# EAGLE schematic Treiber für Stepper-Motoren v14 (EAGLE 9.7.0)
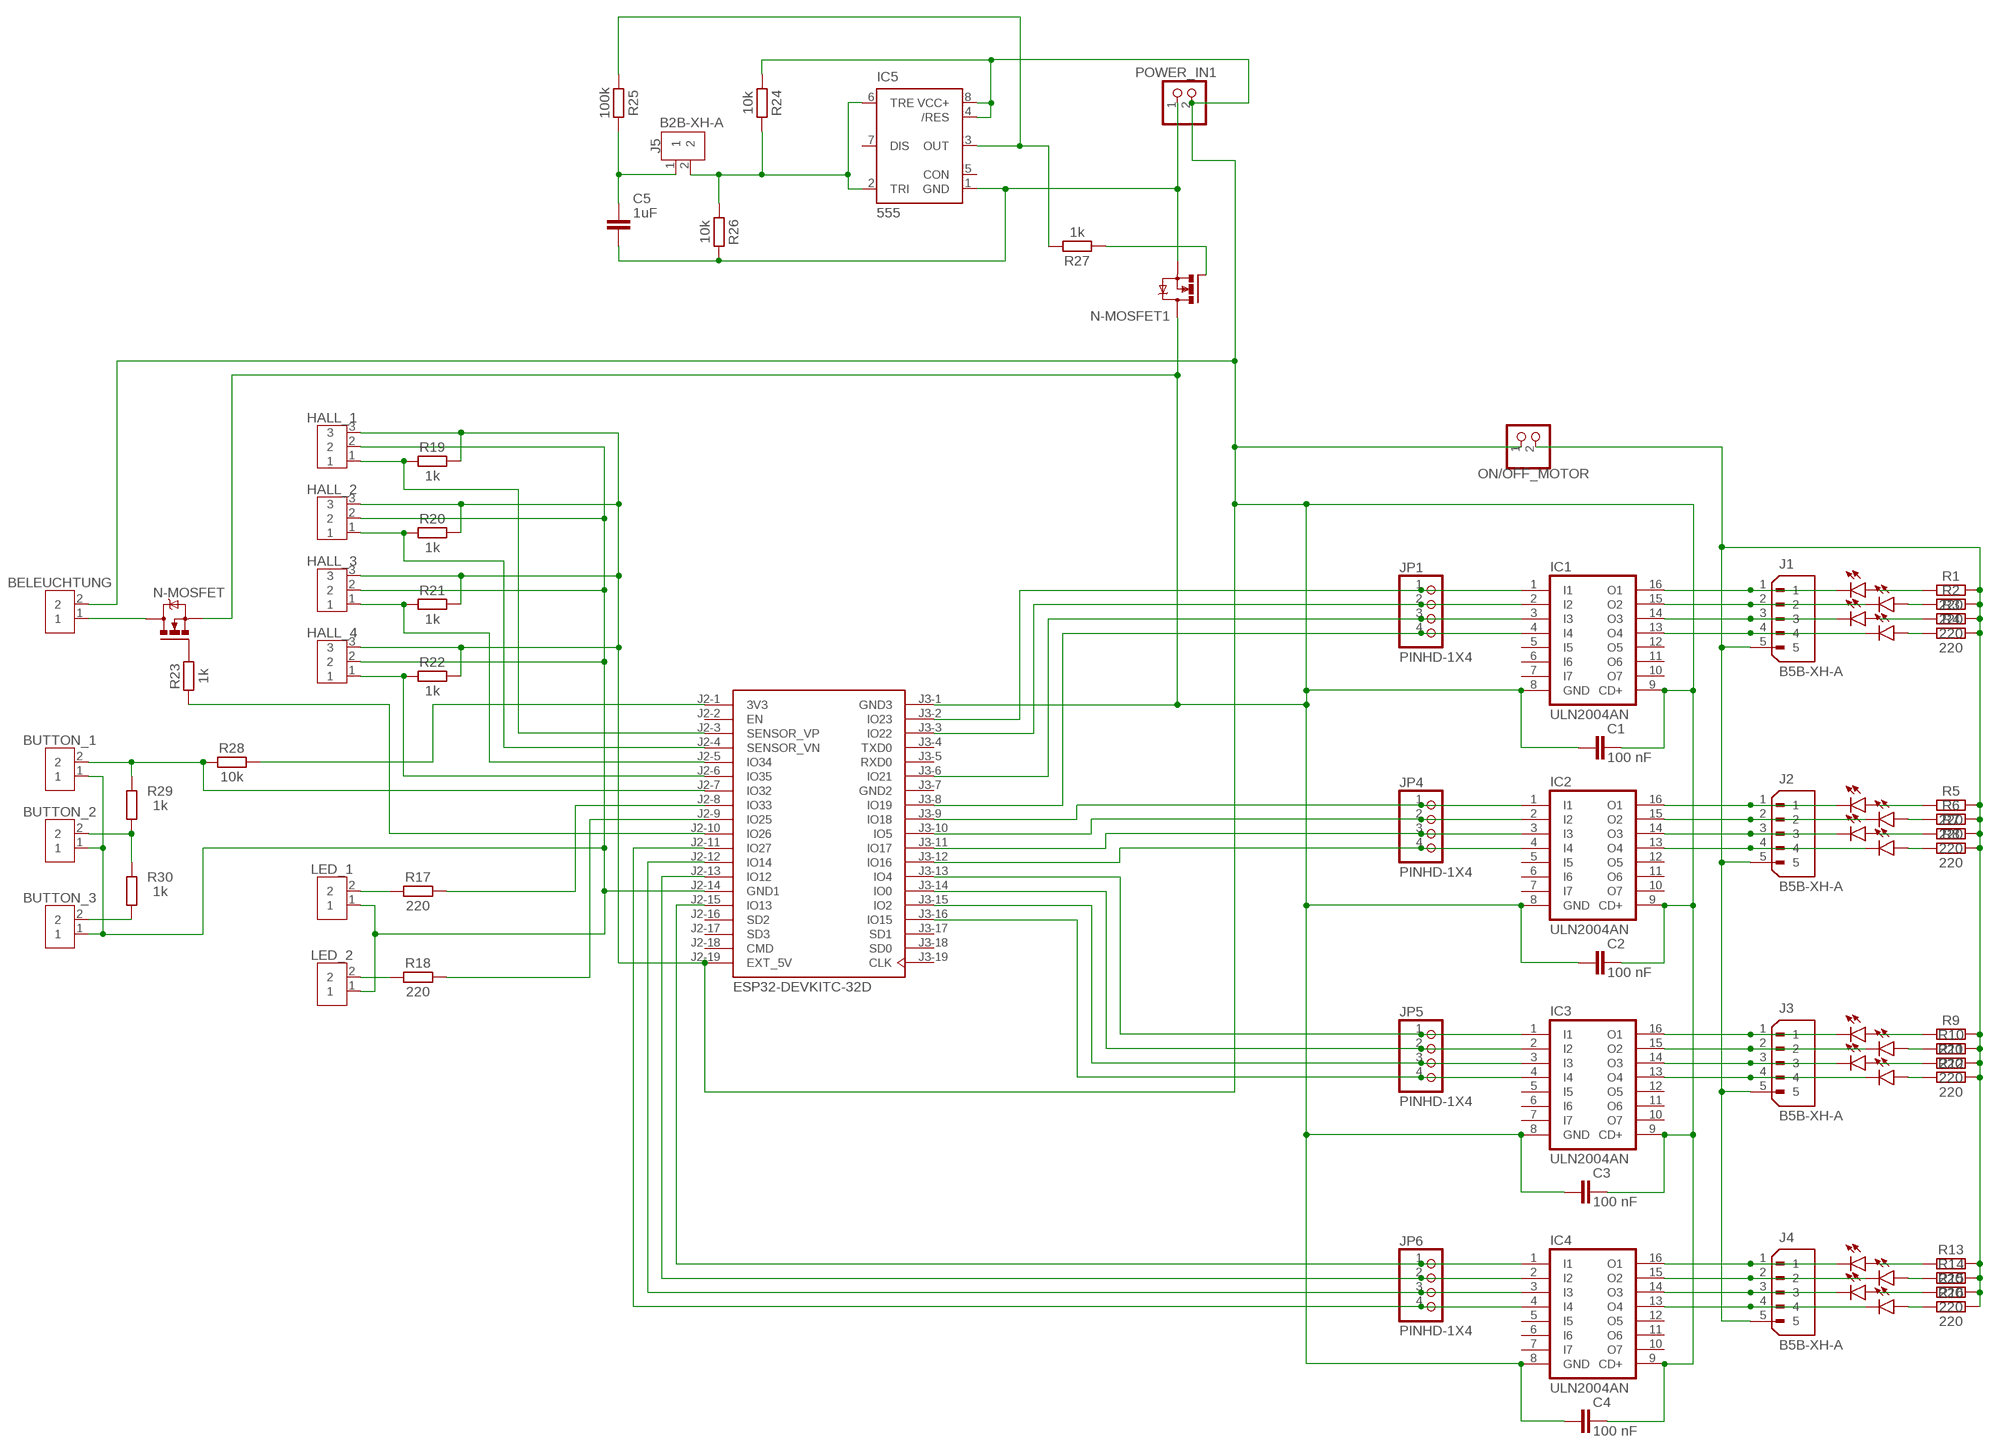
[diagram p0: schematic, sheet 1]

## Parts
BELEUCHTUNG  B2B-XH-A  [B2B-XH-A]
BUTTON_1  B2B-XH-A  [B2B-XH-A]
BUTTON_2  B2B-XH-A  [B2B-XH-A]
BUTTON_3  B2B-XH-A  [B2B-XH-A]
C1  100 nF  C_CHIP-0402(1005-METRIC)  [CAPC1005X60]
C2  100 nF  C_CHIP-0402(1005-METRIC)  [CAPC1005X60]
C3  100 nF  C_CHIP-0402(1005-METRIC)  [CAPC1005X60]
C4  100 nF  C_CHIP-0402(1005-METRIC)  [CAPC1005X60]
C5  1uF  C_CHIP-0603(1608-METRIC)  [CAPC1608X85]
D1  LED_RED  CHIP-FLAT-R_0402  [LEDC1005X25N_FLAT-R]
D2  LED_RED  CHIP-FLAT-R_0402  [LEDC1005X25N_FLAT-R]
D3  LED_RED  CHIP-FLAT-R_0402  [LEDC1005X25N_FLAT-R]
D4  LED_RED  CHIP-FLAT-R_0402  [LEDC1005X25N_FLAT-R]
D5  LED_RED  CHIP-FLAT-R_0402  [LEDC1005X25N_FLAT-R]
D6  LED_RED  CHIP-FLAT-R_0402  [LEDC1005X25N_FLAT-R]
D7  LED_RED  CHIP-FLAT-R_0402  [LEDC1005X25N_FLAT-R]
D8  LED_RED  CHIP-FLAT-R_0402  [LEDC1005X25N_FLAT-R]
D9  LED_RED  CHIP-FLAT-R_0402  [LEDC1005X25N_FLAT-R]
D10  LED_RED  CHIP-FLAT-R_0402  [LEDC1005X25N_FLAT-R]
D11  LED_RED  CHIP-FLAT-R_0402  [LEDC1005X25N_FLAT-R]
D12  LED_RED  CHIP-FLAT-R_0402  [LEDC1005X25N_FLAT-R]
D13  LED_RED  CHIP-FLAT-R_0402  [LEDC1005X25N_FLAT-R]
D14  LED_RED  CHIP-FLAT-R_0402  [LEDC1005X25N_FLAT-R]
D15  LED_RED  CHIP-FLAT-R_0402  [LEDC1005X25N_FLAT-R]
D16  LED_RED  CHIP-FLAT-R_0402  [LEDC1005X25N_FLAT-R]
HALL_1  B3B-XH-A  [B3B-XH-A]
HALL_2  B3B-XH-A  [B3B-XH-A]
HALL_3  B3B-XH-A  [B3B-XH-A]
HALL_4  B3B-XH-A  [B3B-XH-A]
IC1  ULN2004AN  [DIL16]
IC2  ULN2004AN  [DIL16]
IC3  ULN2004AN  [DIL16]
IC4  ULN2004AN  [DIL16]
IC5  555  555D  [SO08]
J1  B5B-XH-A  [JST_B5B-XH-A]
J2  B5B-XH-A  [JST_B5B-XH-A]
J3  B5B-XH-A  [JST_B5B-XH-A]
J4  B5B-XH-A  [JST_B5B-XH-A]
J5  B2B-XH-A  [B2B-XH-A]
JP1  PINHD-1X4  [1X04]
JP4  PINHD-1X4  [1X04]
JP5  PINHD-1X4  [1X04]
JP6  PINHD-1X4  [1X04]
LED_1  B2B-XH-A  [B2B-XH-A]
LED_2  B2B-XH-A  [B2B-XH-A]
N-MOSFET  NMOSFET  NMOSFET_TO220  [TO220BV]
N-MOSFET1  NMOSFET  NMOSFET_TO220  [TO220BV]
ON/OFF_MOTOR  PINHD-1X2  [1X02]
POWER_IN1  PINHD-1X2  [1X02]
R1  220  R_CHIP-0402(1005-METRIC)  [RESC1005X40]
R2  220  R_CHIP-0402(1005-METRIC)  [RESC1005X40]
R3  220  R_CHIP-0402(1005-METRIC)  [RESC1005X40]
R4  220  R_CHIP-0402(1005-METRIC)  [RESC1005X40]
R5  220  R_CHIP-0402(1005-METRIC)  [RESC1005X40]
R6  220  R_CHIP-0402(1005-METRIC)  [RESC1005X40]
R7  220  R_CHIP-0402(1005-METRIC)  [RESC1005X40]
R8  220  R_CHIP-0402(1005-METRIC)  [RESC1005X40]
R9  220  R_CHIP-0402(1005-METRIC)  [RESC1005X40]
R10  220  R_CHIP-0402(1005-METRIC)  [RESC1005X40]
R11  220  R_CHIP-0402(1005-METRIC)  [RESC1005X40]
R12  220  R_CHIP-0402(1005-METRIC)  [RESC1005X40]
R13  220  R_CHIP-0402(1005-METRIC)  [RESC1005X40]
R14  220  R_CHIP-0402(1005-METRIC)  [RESC1005X40]
R15  220  R_CHIP-0402(1005-METRIC)  [RESC1005X40]
R16  220  R_CHIP-0402(1005-METRIC)  [RESC1005X40]
R17  220  R_CHIP-0402(1005-METRIC)  [RESC1005X40]
R18  220  R_CHIP-0402(1005-METRIC)  [RESC1005X40]
R19  1k  R_CHIP-0402(1005-METRIC)  [RESC1005X40]
R20  1k  R_CHIP-0402(1005-METRIC)  [RESC1005X40]
R21  1k  R_CHIP-0402(1005-METRIC)  [RESC1005X40]
R22  1k  R_CHIP-0402(1005-METRIC)  [RESC1005X40]
R23  1k  R_CHIP-0402(1005-METRIC)  [RESC1005X40]
R24  10k  R_CHIP-0603(1608-METRIC)  [RESC1608X60]
R25  100k  R_CHIP-0603(1608-METRIC)  [RESC1608X60]
R26  10k  R_CHIP-0603(1608-METRIC)  [RESC1608X60]
R27  1k  R_CHIP-0402(1005-METRIC)  [RESC1005X40]
R28  10k  R_CHIP-0603(1608-METRIC)  [RESC1608X60]
R29  1k  R_CHIP-0603(1608-METRIC)  [RESC1608X60]
R30  1k  R_CHIP-0603(1608-METRIC)  [RESC1608X60]
U1  ESP32-DEVKITC-32D  [MODULE_ESP32-DEVKITC-32D]

## Nets
N$1: IC1.1(I1) JP1.1 U1.J3-2(IO23)
N$2: IC1.2(I2) JP1.2 U1.J3-3(IO22)
N$3: BUTTON_1.1 BUTTON_2.1 BUTTON_3.1 HALL_1.2 HALL_2.2 HALL_3.2 HALL_4.2 LED_1.1 LED_2.1 U1.J2-14(GND1)
N$4: IC1.4(I4) JP1.4 U1.J3-8(IO19)
N$5: C5.2 IC5.1(GND) N-MOSFET1.S POWER_IN1.1 R26.2
N$6: R23.1 U1.J2-10(IO26)
N$7: D2.C IC1.16(O1) J1.1
N$8: D1.C IC1.15(O2) J1.2
N$9: D3.C IC1.14(O3) J1.3
N$10: D4.C IC1.13(O4) J1.4
N$11: IC2.1(I1) JP4.1 U1.J3-9(IO18)
N$12: D2.A R1.1
N$13: D1.A R2.1
N$14: D3.A R3.1
N$15: D4.A R4.1
N$16: J1.5 J2.5 J3.5 J4.5 ON/OFF_MOTOR.2 R1.2 R2.2 R3.2 R4.2 R5.2 R6.2 R7.2 R8.2 R9.2 R10.2 R11.2 R12.2 R13.2 R14.2 R15.2 R16.2
N$17: IC2.2(I2) JP4.2 U1.J3-10(IO5)
N$18: IC2.3(I3) JP4.3 U1.J3-11(IO17)
N$19: IC2.4(I4) JP4.4 U1.J3-12(IO16)
N$20: IC5.2(TRI) IC5.6(TRE) J5.2 R24.2 R26.1
N$21: IC1.3(I3) JP1.3 U1.J3-6(IO21)
N$22: D5.C IC2.16(O1) J2.1
N$23: D6.C IC2.15(O2) J2.2
N$24: D7.C IC2.14(O3) J2.3
N$25: D8.C IC2.13(O4) J2.4
N$26: D5.A R5.1
N$27: D6.A R6.1
N$28: D7.A R7.1
N$29: D8.A R8.1
N$30: R28.2 U1.J2-1(3V3)
N$31: IC3.1(I1) JP5.1 U1.J3-13(IO4)
N$32: IC3.2(I2) JP5.2 U1.J3-14(IO0)
N$33: IC3.3(I3) JP5.3 U1.J3-15(IO2)
N$34: IC3.4(I4) JP5.4 U1.J3-16(IO15)
N$35: BUTTON_1.2 R28.1 R29.2 U1.J2-7(IO32)
N$36: HALL_2.1 R20.1 U1.J2-4(SENSOR_VN)
N$37: D9.C IC3.16(O1) J3.1
N$38: D10.C IC3.15(O2) J3.2
N$39: D11.C IC3.14(O3) J3.3
N$40: D12.C IC3.13(O4) J3.4
N$41: D9.A R9.1
N$42: D10.A R10.1
N$43: D11.A R11.1
N$44: D12.A R12.1
N$45: BUTTON_3.2 R30.1
N$46: IC4.1(I1) JP6.1 U1.J2-15(IO13)
N$47: IC4.2(I2) JP6.2 U1.J2-13(IO12)
N$48: IC4.3(I3) JP6.3 U1.J2-12(IO14)
N$49: IC4.4(I4) JP6.4 U1.J2-11(IO27)
N$50: BUTTON_2.2 R29.1 R30.2
N$51: N-MOSFET.G R23.2
N$52: D13.C IC4.16(O1) J4.1
N$53: D14.C IC4.15(O2) J4.2
N$54: D15.C IC4.14(O3) J4.3
N$55: D16.C IC4.13(O4) J4.4
N$56: D13.A R13.1
N$57: D14.A R14.1
N$58: D15.A R15.1
N$59: D16.A R16.1
N$60: C5.1 J5.1 R25.2
N$61: LED_1.2 R17.1
N$63: N-MOSFET1.G R27.1
N$64: LED_2.2 R18.1
N$65: R18.2 U1.J2-9(IO25)
N$66: HALL_1.1 R19.1 U1.J2-3(SENSOR_VP)
N$67: HALL_3.1 R21.1 U1.J2-5(IO34)
N$68: HALL_4.1 R22.1 U1.J2-6(IO35)
N$69: BELEUCHTUNG.1 N-MOSFET.D
N$70: R17.2 U1.J2-8(IO33)
N$71: IC5.3(OUT) R25.1 R27.2
N$72: BELEUCHTUNG.2 C1.1 C1.2 C2.1 C2.2 C3.1 C3.2 C4.1 C4.2 HALL_1.3 HALL_2.3 HALL_3.3 HALL_4.3 IC1.8(GND) IC1.9(CD+) IC2.8(GND) IC2.9(CD+) IC3.8(GND) IC3.9(CD+) IC4.8(GND) IC4.9(CD+) IC5.4(/RES) IC5.8(VCC+) N-MOSFET1.D N-MOSFET.S ON/OFF_MOTOR.1 POWER_IN1.2 R19.2 R20.2 R21.2 R22.2 R24.1 U1.J2-19(EXT_5V) U1.J3-1(GND3)
Unconnected: IC1.5(I5) IC1.6(I6) IC1.7(I7) IC1.10(O7) IC1.11(O6) IC1.12(O5) IC2.5(I5) IC2.6(I6) IC2.7(I7) IC2.10(O7) IC2.11(O6) IC2.12(O5) IC3.5(I5) IC3.6(I6) IC3.7(I7) IC3.10(O7) IC3.11(O6) IC3.12(O5) IC4.5(I5) IC4.6(I6) IC4.7(I7) IC4.10(O7) IC4.11(O6) IC4.12(O5) IC5.5(CON) IC5.7(DIS) U1.J2-2(EN) U1.J2-16(SD2) U1.J2-17(SD3) U1.J2-18(CMD) U1.J3-4(TXD0) U1.J3-5(RXD0) U1.J3-17(SD1) U1.J3-18(SD0) U1.J3-19(CLK)

## Power pins joined to a net without a drawn wire
GND2: U1.J3-7(GND2)

## Library data of the parts
BELEUCHTUNG BUTTON_1-BUTTON_3 J5 LED_1 LED_2 = Connector:B2B-XH-A: XH Connector Top Entry - 2POS Details see: Datasheet <http://www.jst-mfg.com/product/pdf/eng/eXH.pdf>; CATEGORY: Header; DESCRIPTION: Connector Header Through Hole 2 position 0.098" (2.50mm); MANUFACTURER: JST Sales America Inc.; MPN: B2B-XH-A(LF)(SN); OPERATING_TEMPERATURE: -25°C ~ 85°C; PART_STATUS: ACTIVE; PITCH: 0.098" (2.50mm); ROHS_COMPLIANCE: ROHS3 Compliant; SERIES: XH; SUB_CATEGORY: Rectangular Connectors; TYPE: Header, Male Pin, Board to Cable/Wire, Through Hole
C1-C5 = Capacitor:C: Capacitor - Generic; CATEGORY: Capacitor
D1-D16 = LED:CHIP-FLAT-R; CATEGORY: LED; COLOR: RED; DESCRIPTION: CHIP LED FLAT; SUB-CATEGORY: CHIP; TYPE: FLAT_TOP
HALL_1-HALL_4 = Connector:B3B-XH-A: XH Connector Top Entry - 3POS Details see: Datasheet <http://www.jst-mfg.com/product/pdf/eng/eXH.pdf>; CATEGORY: Header; DESCRIPTION: Connector Header Through Hole 3 position 0.098" (2.50mm); MANUFACTURER: JST Sales America Inc.; MPN: B3B-XH-A(LF)(SN); PART_STATUS: ACTIVE; PITCH: 0.098" (2.50mm); ROHS_COMPLIANCE: ROHS3 Compliant; SERIES: XH; SUB_CATEGORY: Rectangular Connectors; TYPE: Header, Male Pin, Board to Cable/Wire, Through Hole
IC1-IC4 = ULN2004A:ULN2004A: DRIVER ARRAY Check availability <https://pricing.snapeda.com/parts/ULN2004A/STMicroelectronics/view-part?ref=eda>; AVAILABILITY: In Stock; CHECK_PRICES: https://www.snapeda.com/parts/ULN2004A/STMicroelectronics/view-part/?ref=eda; DESCRIPTION: Bipolar (BJT) Transistor Array 7 NPN Darlington 50V 500mA - - Through Hole 16-DIP; MF: STMicroelectronics; MP: ULN2004A; PACKAGE: PDIP-16 ON Semiconductor; PRICE: None; PURCHASE-URL: https://www.snapeda.com/api/url_track_click_mouser/?unipart_id=45236&manufacturer=STMicroelectronics&part_name=ULN2004A&search_term=uln200; SNAPEDA_LINK: https://www.snapeda.com/parts/ULN2004A/STMicroelectronics/view-part/?ref=snap
IC5 = SparkFun-IC-Special-Function:555: General purpose bipolar Timer Datasheet <http://www.sparkfun.com/datasheets/Components/General/ne555.pdf> SparkFun Products SparkFun SparkPunk Sequencer Kit <https://www.sparkfun.com/products/12707> (KIT-12707) Storefront Component: 555 Timer <https://www.sparkfun.com/products/9273> (COM-09273) Two parts valid for production: VFP: IC-11930 (M7555 PTH) VFP: IC-09173 (555 PTH) - Preferred; PROD_ID: NA-XXXXX
J1-J4 = B5B-XH-A:B5B-XH-A: Check availability <https://pricing.snapeda.com/parts/B5B-XH-A/JST%20Sales/view-part?ref=eda>; AVAILABILITY: In Stock; CHECK_PRICES: https://www.snapeda.com/parts/B5B-XH-A/JST+Sales+America+Inc./view-part/?ref=eda; DESCRIPTION: Connector Header Through Hole 5 position 0.098 (2.50mm); MF: JST Sales; MP: B5B-XH-A; PACKAGE: None; PRICE: None; SNAPEDA_LINK: https://www.snapeda.com/parts/B5B-XH-A/JST+Sales+America+Inc./view-part/?ref=snap
JP1 JP4-JP6 = Connector:PINHD-1X4: PIN HEADER; CATEGORY: Headers; DESCRIPTION: Header, Straight, 4 Position; MANUFACTURER: Generic; MPN: Generic; OPERATING_TEMPERATURE: Generic; PART_STATUS: Active; PITCH: 0.100" (2.54mm); ROHS_COMPLIANCE: Generic; SERIES: Generic; SUB-CATEGORY: Headers, Male Pins; TYPE: Board to Board or Cable, Unshrouded, Through Hole, Straight
N-MOSFET N-MOSFET1 = Transistor:NMOSFET: N-Channel MOSFET - Generic; CATEGORY: Transistor; SUB-CATEGORY: MOSFET; TYPE: N-Channel
ON/OFF_MOTOR POWER_IN1 = Connector:PINHD-1X2: PIN HEADER; CATEGORY: Headers; DESCRIPTION: Header, Straight, 2 Position; MANUFACTURER: Generic; MPN: Generic; OPERATING_TEMPERATURE: Generic; PART_STATUS: Active; PITCH: 0.100" (2.54mm); ROHS_COMPLIANCE: Generic; SERIES: Generic; SUB-CATEGORY: Headers, Male Pins; TYPE: Board to Board or Cable, Unshrouded, Through Hole, Straight
R1-R30 = Resistor:R: Resistor Fixed - Generic; CATEGORY: Resistor; SUB-CATEGORY: Fixed
U1 = ESP32-DEVKITC-32D:ESP32-DEVKITC-32D: Check availability <https://pricing.snapeda.com/parts/ESP32-DEVKITC-32D/Espressif%20Systems/view-part?ref=eda>; AVAILABILITY: In Stock; CHECK_PRICES: https://www.snapeda.com/parts/ESP32-DEVKITC-32D/Espressif+Systems/view-part/?ref=eda; DESCRIPTION: WiFi Development Tools (802.11) ESP32 General Development Kit, ESP32-WROOM-32D on the board; MF: Espressif Systems; MP: ESP32-DEVKITC-32D; PACKAGE: None; PRICE: None; SNAPEDA_LINK: https://www.snapeda.com/parts/ESP32-DEVKITC-32D/Espressif+Systems/view-part/?ref=snap